# Altium schematic sheet MCU.SchDoc
size A4; SheetNumber: 8; SheetTotal: 8
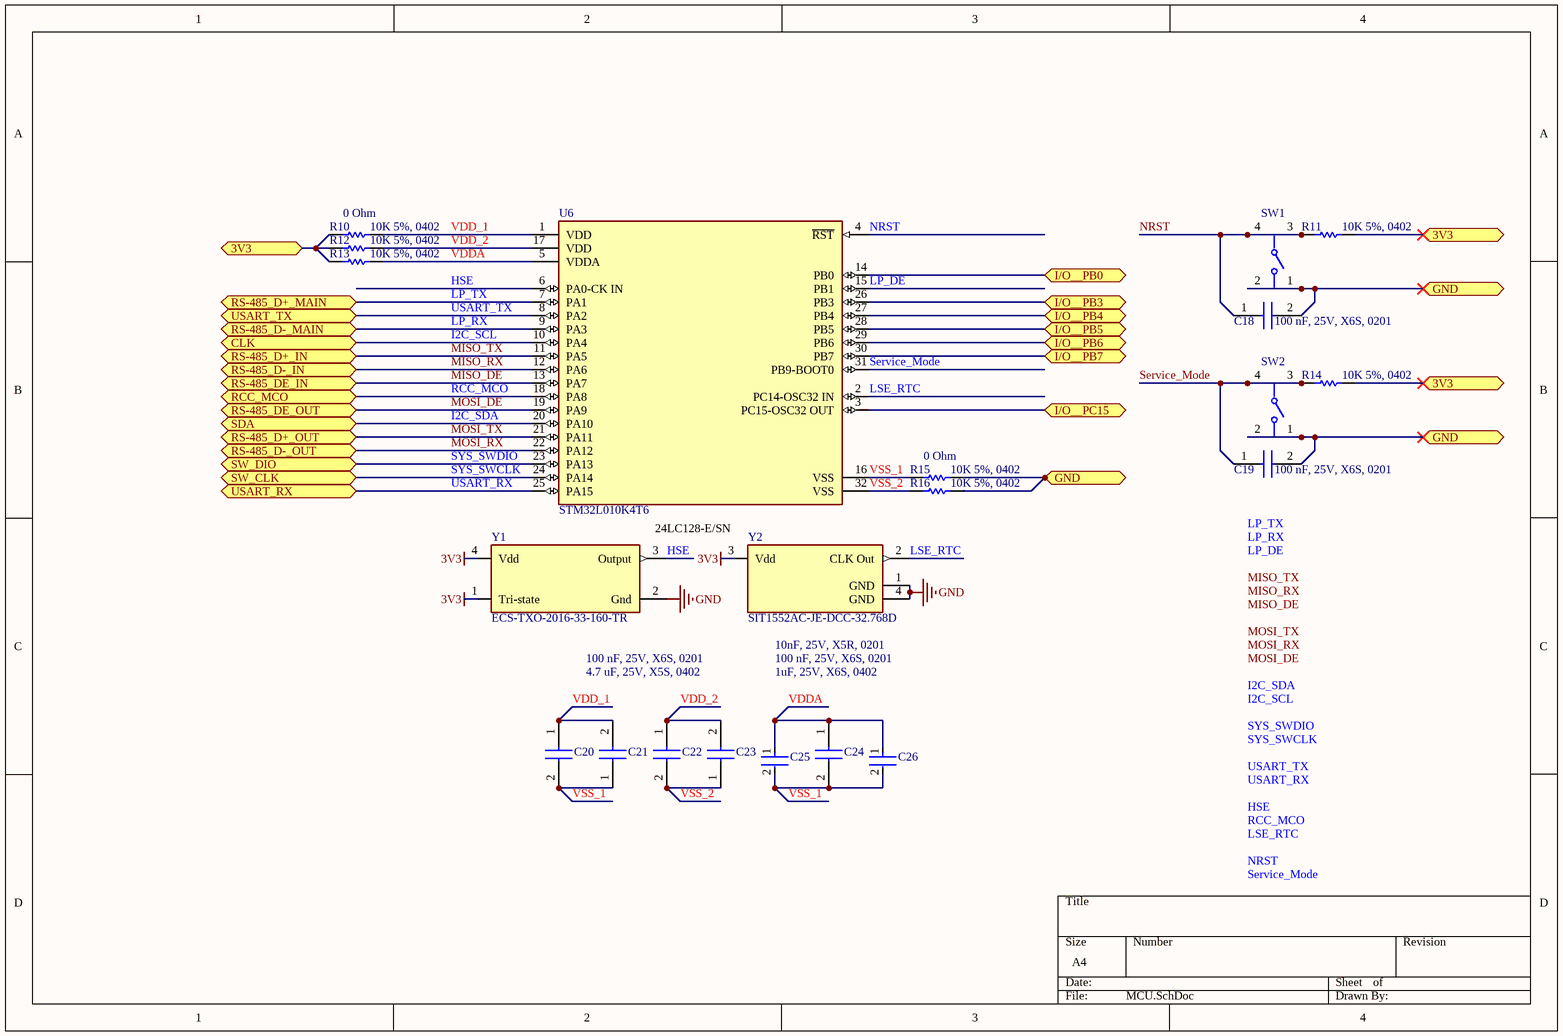
[diagram p0: MCU.SchDoc]

## Parts
C18  100 nF, 25V, X6S, 0201  [CAPC0603X33N]  (value not drawn)
C19  100 nF, 25V, X6S, 0201  [CAPC0603X33N]  (value not drawn)
C20  100 nF, 25V, X6S, 0201  [CAPC0603X33N]  (value not drawn)
C21  4.7 uF, 25V, X5S, 0402  [GRM15x]  (value not drawn)
C22  100 nF, 25V, X6S, 0201  [CAPC0603X33N]  (value not drawn)
C23  4.7 uF, 25V, X5S, 0402  [GRM15x]  (value not drawn)
C24  100 nF, 25V, X6S, 0201  [CAPC0603X33N]  (value not drawn)
C25  10nF, 25V, X5R, 0201  [FP-GRM033-0_03-IPC_C]  (value not drawn)
C26  1uF, 25V, X6S, 0402  [FP-GRT155-0_1-IPC_A]  (value not drawn)
R10  10K 5%, 0402  [RESC1005X40X25ML05T05]
R11  10K 5%, 0402  [RESC1005X40X25ML05T05]
R12  10K 5%, 0402  [RESC1005X40X25ML05T05]
R13  10K 5%, 0402  [RESC1005X40X25ML05T05]
R14  10K 5%, 0402  [RESC1005X40X25ML05T05]
R15  10K 5%, 0402  [RESC1005X40X25ML05T05]
R16  10K 5%, 0402  [RESC1005X40X25ML05T05]
SW1  PTS810SJM250SMTRLFS  [FP-PTS810SJM250SMTRLFS-MFG]  (value not drawn)
SW2  PTS810SJM250SMTRLFS  [FP-PTS810SJM250SMTRLFS-MFG]  (value not drawn)
U6  STM32L010K4T6  [FP-LQFP32-5V-MFG]
Y1  ECS-TXO-2016-33-160-TR  [FP-TXO-2016-MFG]
Y2  SIT1552AC-JE-DCC-32.768D  [FP-SiT1552-J-MFG]

## Ports
3V3 (bidir, see CellVoltageControl[3A], LDO_3V3[3B]), CLK (bidir), GND (bidir, see CellVoltageControl[2B], CellSelectModule[2C], ISO_Power[1C]), I/O__PB0 (bidir, see CellVoltageControl[2B]), I/O__PB3 (bidir, see CellVoltageControl[2B]), I/O__PB4 (bidir, see CellVoltageControl[2B]), I/O__PB5 (bidir, see CellVoltageControl[2B]), I/O__PB6 (bidir, see CellVoltageControl[2B]), I/O__PB7 (bidir, see CellVoltageControl[2B]), I/O__PC15 (bidir, see CellVoltageControl[2B]), RCC_MCO (bidir, see CellVoltageControl[2A]), RS-485_D+_IN (bidir, see CellVoltageControl[3A]), RS-485_D+_MAIN (bidir, see CellVoltageControl[3A]), RS-485_D+_OUT (bidir, see CellVoltageControl[3B]), RS-485_D-_IN (bidir, see CellVoltageControl[3A]), RS-485_D-_MAIN (bidir, see CellVoltageControl[3A]), RS-485_D-_OUT (bidir, see CellVoltageControl[3B]), RS-485_DE_IN (bidir, see CellVoltageControl[3A]), RS-485_DE_OUT (bidir, see CellVoltageControl[3B]), SDA (bidir), SW_CLK (bidir, see CellVoltageControl[2A]), SW_DIO (bidir, see CellVoltageControl[2A]), USART_RX (bidir, see CellVoltageControl[2A]), USART_TX (bidir, see CellVoltageControl[2A])

## Nets
3V3: Y1.1(Tri-state) Y1.4(Vdd) Y2.3(Vdd)
GND: Y1.2(Gnd) Y2.1(GND) Y2.4(GND)
3V3: R10.2 R11.1 R12.2 R13.2 R14.1 ; port 3V3  [a separate net that carries the same name]
GND: C18.2 C19.2 R15.1 R16.1 SW1.1 SW1.2 SW2.1 SW2.2 ; port GND  [a separate net that carries the same name]
HSE: U6.6(PA0-CK_IN) Y1.3(Output)
I2C_SCL: U6.10(PA4) ; port CLK
I2C_SDA: U6.20(PA10) ; port SDA
I/O__PB0: U6.14(PB0) ; port I/O__PB0
I/O__PB3: U6.26(PB3) ; port I/O__PB3
I/O__PB4: U6.27(PB4) ; port I/O__PB4
I/O__PB5: U6.28(PB5) ; port I/O__PB5
I/O__PB6: U6.29(PB6) ; port I/O__PB6
I/O__PB7: U6.30(PB7) ; port I/O__PB7
I/O__PC15: U6.3(PC15-OSC32_OUT) ; port I/O__PC15
LP_DE: U6.15(PB1)
LP_RX: U6.9(PA3) ; port RS-485_D-_MAIN
LP_TX: U6.7(PA1) ; port RS-485_D+_MAIN
LSE_RTC: U6.2(PC14-OSC32_IN) Y2.2(CLK_Out)
MISO_DE: U6.13(PA7) ; port RS-485_DE_IN
MISO_RX: U6.12(PA6) ; port RS-485_D-_IN
MISO_TX: U6.11(PA5) ; port RS-485_D+_IN
MOSI_DE: U6.19(PA9) ; port RS-485_DE_OUT
MOSI_RX: U6.22(PA12) ; port RS-485_D-_OUT
MOSI_TX: U6.21(PA11) ; port RS-485_D+_OUT
NRST: C18.1 R11.2 SW1.3 SW1.4 U6.4(~{RST})
RCC_MCO: U6.18(PA8) ; port RCC_MCO
Service_Mode: C19.1 R14.2 SW2.3 SW2.4 U6.31(PB9-BOOT0)
SYS_SWCLK: U6.24(PA14) ; port SW_CLK
SYS_SWDIO: U6.23(PA13) ; port SW_DIO
USART_RX: U6.25(PA15) ; port USART_RX
USART_TX: U6.8(PA2) ; port USART_TX
VDD_1: C20.1 C21.2 R10.1 U6.1(VDD)
VDD_2: C22.1 C23.2 R12.1 U6.17(VDD)
VDDA: C24.1 C25.1 C26.1 R13.1 U6.5(VDDA)
VSS_1: C20.2 C21.1 C24.2 C25.2 C26.2 R15.2 U6.16(VSS)
VSS_2: C22.2 C23.1 R16.2 U6.32(VSS)

## Notes on the sheet
- (near R10) 0 Ohm
- (near C18) 100 nF, 25V, X6S, 0201
- (near R15) 0 Ohm
- (near C19) 100 nF, 25V, X6S, 0201
- 24LC128-E/SN
- (near Y2) 10nF, 25V, X5R, 0201
- 4.7 uF, 25V, X5S, 0402
- 100 nF, 25V, X6S, 0201
- 1uF, 25V, X6S, 0402
- Labels drawn without touching a wire or pin: HSE, I2C_SCL, I2C_SDA, LP_DE, LP_RX, LP_TX, LSE_RTC, MISO_DE, MISO_RX, MISO_TX, MOSI_DE, MOSI_RX, MOSI_TX, NRST, RCC_MCO, Service_Mode, SYS_SWCLK, SYS_SWDIO, USART_RX, USART_TX

## Library data of the parts
C18-C20 C22 C24 = GRM033C81E104KE14D: Capacitor; Manufacturer_Name: Murata Electronics; Datasheet Link: https://search.murata.co.jp/Ceramy/image/img/A01X/G101/ENG/GRM033C81E104KE14-01A.pdf; Height: 0.33mm; Manufacturer_Part_Number: GRM033C81E104KE14D; Mouser Part Number: 81-GRM33C81E104KE14D; Mouser Price/Stock: https://www.mouser.co.uk/ProductDetail/Murata-Electronics/GRM033C81E104KE14D?qs=P%2FC4Eoq9CDwxe7d5nXqGrA%3D%3D; Arrow Part Number: GRM033C81E104KE14D; Arrow Price/Stock: https://www.arrow.com/en/products/grm033c81e104ke14d/murata-manufacturing
C21 C23 = GRM155C61E475ME15J: Capacitor; Manufacturer_Name: Murata Electronics; Datasheet Link: https://search.murata.co.jp/Ceramy/image/img/A01X/G101/ENG/GRM155C61E475ME15-01A.pdf; Height: 0.33mm; Manufacturer_Part_Number: GRM155C61E475ME15J; Mouser Part Number: 81-GRM15C61E475ME15J; Mouser Price/Stock: https://www.mouser.co.uk/ProductDetail/Murata-Electronics/GRM155C61E475ME15J?qs=By6Nw2ByBD02p8xq06vhEQ%3D%3D; Arrow Part Number: GRM155C61E475ME15J; Arrow Price/Stock: https://www.arrow.com/en/products/grm155c61e475me15j/murata-manufacturing?region=nac
C25 = CMP-2010-01269-2: Chip Multilayer Ceramic Capacitors for General Purpose, 0201, 10000pF, X5R, 15%, 10%, 25V; Capacitance: 10nF; Weight: 1.2E-05oz; Tolerance: 10%; Length: 0.6mm; Case Code (Metric): 0603; Min Operating Temperature: -55°C; Lead Free: Lead Free; Mount: Surface Mount; Voltage: 25V; REACH SVHC: No SVHC; Dielectric: X5R; Case Code (Imperial): 0201; Depth: 0.3mm; Packaging: Tape and Reel; Package Quantity: 15000; Case/Package: 0201; Voltage Rating (DC): 25V; Height: 0.3mm; Max Operating Temperature: 85°C; Termination: SMD/SMT; Voltage Rating: 25V; Width: 0.3mm; Thickness: 0.013inch
C26 = CMP-06035-047663-1: Multi-Layer Ceramic Capacitor 1uF 25V X6S ±10% 0402 Paper T/R
R10-R16 = CMP-2002-00433-1: Part Number: ERJ-2GEJ103X; Manufacturer: Panasonic
SW1 SW2 = CMP-10040-000001-2: SWITCH TACTILE SPST-NO 0.05A 16V; Throw Configuration: SPST; Operating Force: 160gf; Actuator Type: Standard; Switch Travel: 0.15mm; Switch Function: Off-Mom; Max Current Rating: 50mA; Mechanical Life: 150000Cycles; Illumination Type: Non-Illuminated; Package Quantity: 2900; Depth: 4.6mm; Mount: Surface Mount; Packaging: Tape and Reel; Length: 3.2mm; RoHS Compliant: Yes; Case/Package: SMD/SMT; Voltage Rating (DC): 16V; Min Operating Temperature: -40°C; Termination: J-Bend; Lead Free: Lead Free; Contact Plating: Silver; Orientation: Straight; Max Operating Temperature: 85°C; Current Rating: 50mA; Color: Black
U6 = CMP-12105-000001-1: 16/32-BITS MICROS; Manufacturer: STMicroelectronics; Number Of Cores: 1; Core Architecture: ARM Cortex-M0+; Number Of Adc Channels: 10; Data Bus Width: 32bits; Frequency: 32MHz; Number Of I/Os: 26; Memory Size: 16KBytes; Max Junction Temp: +105°C; Memory Type: FLASH; Number Of Uart Channels: 2; Ram Size: 2KBytes; Number Of Timers/Counters: 5; Nominal Supply Current: 22-5400uA; Interface: I2C,SPI,UART,USART,SMBus; Min Supply Voltage: 1.8V; Max Supply Voltage: 3.6V; Standoff Height: 0.05mm; ComponentLink2Description: Datasheet; Temperature Range High: +85°C; Device Class L2: Embedded Processors and Controllers; Package: LQFP32-5V; Manufacturer Part Number: STM32L010K4T6; Ambient Temperature Range Low: -40°C; RoHS: TRUE; Digikey Description: 16/32-BITS MICROS; Lead Free: Yes; Category: IC; Height: 1.6mm; ComponentLink2URL: https://www.st.com/resource/en/datasheet/stm32l010f4.pdf; Temperature Range Low: -40°C; Automotive: No; Device Class L3: Microcontrollers; Device Class L1: Integrated Circuits (ICs); Octopart: https://octopart.com/stm32l010k4t6-stmicroelectronics-96493833; Temperature: -40°C to +85°C; Number Of Spi Channels: 1; Number Of I2C Channels: 1; Ambient Temperature Range High: +85°C; Number Of A/D Converters: 1
Y1 = CMP-40224-000008-1: XTAL OSC TCXO 16MHZ 3.3V SMD; Manufacturer: ECS; Max Supply Voltage: 3.63V; Max Supply Current: 7mA; Stability: 2ppm; Min Supply Voltage: 2.97V; Load Capacitance: 15pF; Frequency: 16MHz; Device Class L1: Passive Components; Manufacturer Part Number: ECS-TXO-2016-33-160-TR; Digikey Description: XTAL OSC TCXO 16MHZ 3.3V SMD; Device Class L3: Oscillators; Category: Crys; Lead Free: Yes; Temperature: -40°C to +85°C; RoHS: TRUE; ComponentLink2Description: Datasheet; Octopart: https://octopart.com/ecs-txo-2016-33-160-tr-ecs+international-102811109; ComponentLink2URL: https://ecsxtal.com/store/pdf/ECS-TXO-2016.pdf; Temperature Range High: +85°C; Height: 0.8mm; Device Class L2: Crystals / Oscillators; Package: TXO-2016; Temperature Range Low: -40°C; Series: TXO-2016; Automotive: No
Y2 = CMP-25159-260295-1: MEMS OSC TCXO 32.7680KHZ LVCMOS; Frequency Stability: 5ppm; Frequency: 32.768kHz; Min Operating Temperature: 0°C; Length: 0.061inch; Mount: Surface Mount; Max Operating Temperature: 70°C; Width: 0.033inch; RoHS Compliant: Yes; Series: SiT1552; Packaging: Cut Tape; Height: 0.024inch